# EAGLE design fan_thermo_board (EAGLE 6.4)
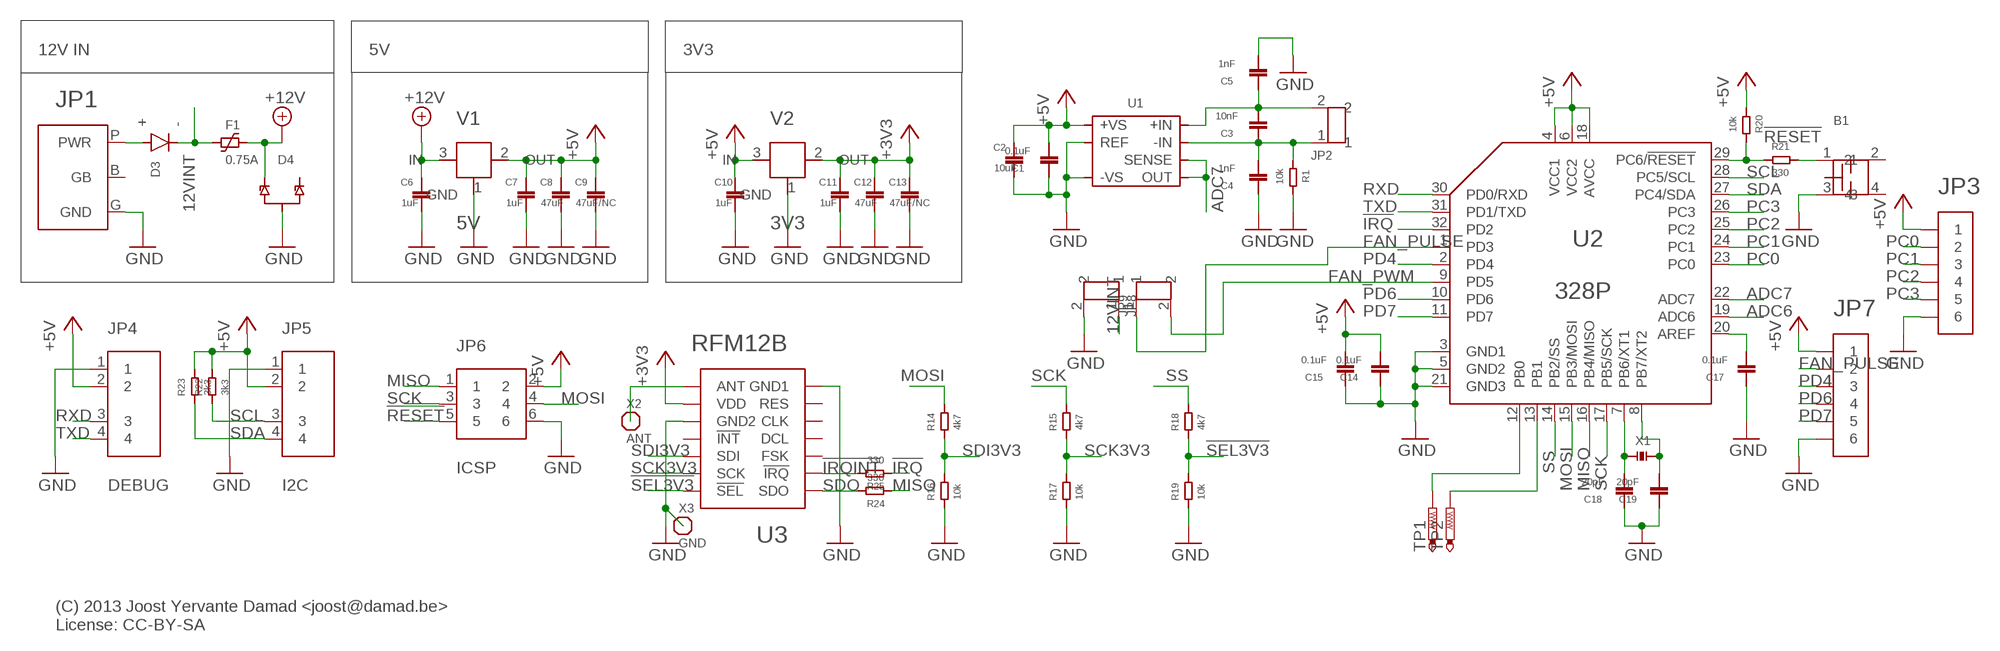
[diagram p0: schematic, sheet 1]

## Parts
B1  BUTTON_ALPS_5.2MM_SMD  [BUTTON_ALPS_SMD_5.2MM_SKQG]
C1  0.1uF  C0603  [0603@1]
C2  10uF  CAPACITOR1206  [1206]
C3  10nF  C0603  [0603@1]
C4  1nF  C0603  [0603@1]
C5  1nF  C0603  [0603@1]
C6  1uF  CAPACITOR0603  [0603]
C7  1uF  CAPACITOR0603  [0603]
C8  47uF  CAPACITOR1206  [1206]
C9  47uF/NC  CAPACITOR1206  [1206]
C10  1uF  CAPACITOR0603  [0603]
C11  1uF  CAPACITOR0603  [0603]
C12  47uF  CAPACITOR1206  [1206]
C13  47uF/NC  CAPACITOR1206  [1206]
C14  0.1uF  C0603  [0603@1]
C15  0.1uF  C0603  [0603@1]
C17  0.1uF  C0603  [0603@1]
C18  20pF  C0603  [0603@1]
C19  20pF  C0603  [0603@1]
D3  DIODE  [TAIW_SEM_DIODE]
D4  DUAL_TVSSOT-23  [SOT-23]
F1  0.75A  TE_POLYFUSE_1812  [TE_POLYFUSE_1812]
JP1  POWER_PLUG_2.1MM  [POWER_PLUG_2.1MM]
JP2  WAGO500-2PIN  [WAGO_500_SCREW_TERMINAL_2_PIN]
JP3  PIN1X6  [PIN_1X6]
JP4  DEBUG  PIN1X4PTH2.54  [PIN_1X4]
JP5  I2C  PIN1X4JSTSIDE  [JST-S-4B-XH-A]
JP6  ICSP  PIN2X32X3ALT  [PIN_2X3_ALT]
JP7  PIN1X6  [PIN_1X6]
JP8  WAGO500-2PIN  [WAGO_500_SCREW_TERMINAL_2_PIN]
JP9  WAGO500-2PIN  [WAGO_500_SCREW_TERMINAL_2_PIN]
R1  10k  RESISTOR0603  [0603]
R14  4k7  RESISTOR0603  [0603]
R15  4k7  RESISTOR0603  [0603]
R16  10k  RESISTOR0603  [0603]
R17  10k  RESISTOR0603  [0603]
R18  4k7  RESISTOR0603  [0603]
R19  10k  RESISTOR0603  [0603]
R20  10k  RESISTOR0603  [0603]
R21  330  RESISTOR0603  [0603]
R22  3k3  RESISTOR0603  [0603]
R23  3k3  RESISTOR0603  [0603]
R24  330  RESISTOR0603  [0603]
R25  330  RESISTOR0603  [0603]
TP1  PTR1B1,27  [B1,27]
TP2  PTR1B1,27  [B1,27]
U1  AD8495  [JEDEC_MO-187-AA]
U2  328P  ATMEGA328PTQFP32  [TQFP32]
U3  RFM12B  [RFM12B]
V1  5V  VREG_MCP1703  [SOT-23A]
V2  3V3  VREG_MCP1703  [SOT-23A]
X1  CRYSTAL  [CRYSTAL_2-PAD_5X3.2MM]
X2  ANT  PIN1X1  [PIN_1X1]
X3  GND  PIN1X1  [PIN_1X1]

## Nets
12VINT: D3.- F1.1 JP8.1
!IRQ: R25.1 U2.32(PD2)
!IRQINT: R25.2 U3.NIRQ(!IRQ)
!RESET: JP6.5 R20.2 R21.1 U2.29(PC6/!RESET)
!SEL3V3: R18.1 R19.2 U3.NSEL(!SEL)
+3V3: C11.2 C12.1 C13.1 U3.VDD V2.2(OUT)
+5V: C1.1 C2.1 C7.2 C8.1 C9.1 C10.2 C14.1 C15.1 JP3.1 JP4.2 JP5.2 JP6.2 JP7.1 R20.1 R22.2 R23.2 U1.7(+VS) U2.4(VCC1) U2.6(VCC2) U2.18(AVCC) V1.2(OUT) V2.3(IN)
+12V: C6.2 D4.1 F1.2 V1.3(IN)
ADC6: U2.19(ADC6)
ADC7: U1.5(SENSE) U1.6(OUT) U2.22(ADC7)
FAN_PULSE: JP7.2 JP9.1 U2.1(PD3)
FAN_PWM: JP9.2 U2.9(PD5)
GND: B1.3 C1.2 C2.2 C4.2 C5.1 C6.1 C7.1 C8.2 C9.2 C10.1 C11.1 C12.2 C13.2 C14.2 C15.2 C17.2 C18.2 C19.2 D4.3(G1) JP1.G(GND) JP3.6 JP4.1 JP5.1 JP6.6 JP7.6 JP8.2 R1.2 R16.1 R17.1 R19.1 U1.2(REF) U1.3(-VS) U2.3(GND1) U2.5(GND2) U2.21(GND3) U3.GND@1(GND1) U3.GND@2(GND2) V1.1(GND) V2.1(GND) X3.1
IN+: C3.1 C5.2 JP2.2 U1.8(+IN)
IN-: C3.2 C4.1 JP2.1 R1.1 U1.1(-IN)
MISO: JP6.1 R24.1 U2.16(PB4/MISO)
MOSI: JP6.4 R14.2 U2.15(PB3/MOSI)
N$3: TP2.TP U2.13(PB1)
N$4: TP1.TP U2.12(PB0)
N$11: D3.+ JP1.P(PWR)
N$13: U3.ANT X2.1
N$14: C17.1 U2.20(AREF)
N$16: B1.1 R21.2
N$17: C18.1 U2.7(PB6/XT1) X1.1
N$18: C19.1 U2.8(PB7/XT2) X1.2
PC0: JP3.2 U2.23(PC0)
PC1: JP3.3 U2.24(PC1)
PC2: JP3.4 U2.25(PC2)
PC3: JP3.5 U2.26(PC3)
PD4: JP7.3 U2.2(PD4)
PD6: JP7.4 U2.10(PD6)
PD7: JP7.5 U2.11(PD7)
RXD: JP4.3 U2.30(PD0/RXD)
SCK: JP6.3 R15.2 U2.17(PB5/SCK)
SCK3V3: R15.1 R17.2 U3.SCK
SCL: JP5.3 R22.1 U2.28(PC5/SCL)
SDA: JP5.4 R23.1 U2.27(PC4/SDA)
SDI3V3: R14.1 R16.2 U3.SDI
SDO: R24.2 U3.SDO
SS: R18.2 U2.14(PB2/SS)
TXD: JP4.4 U2.31(PD1/TXD)
Unconnected: B1.2 B1.4 D4.2 JP1.B(GB) U3.CLK U3.DCL U3.FSK U3.NINT(!INT) U3.RES

## Notes on the sheet
- 12V IN | 5V | 3V3
- (C) 2013 Joost Yervante Damad <joost@damad.be>
  License: CC-BY-SA

## Library data of the parts
B1 = 01jyd:BUTTON_ALPS_5.2MM_SMD
C1 C3-C5 C14 C15 C17-C19 = 01jyd:C0603
C2 C6-C13 = 01jyd:CAPACITOR
D3 = 01jyd:DIODE
D4 = 01jyd:DUAL_TVS
F1 = 01jyd:TE_POLYFUSE_1812
JP1 = 01jyd:POWER_PLUG_2.1MM
JP2 JP8 JP9 = 01jyd:WAGO500-2PIN
JP3 JP7 = 01jyd:PIN1X6
JP4 JP5 = 01jyd:PIN1X4
JP6 = 01jyd:PIN2X3
R1 R14-R25 = 01jyd:RESISTOR
TP1 TP2 = testpad:PTR1: TEST PIN
U1 = 01jyd:AD8495
U2 = 01jyd:ATMEGA328P
U3 = 01jyd:RFM12B
V1 V2 = 01jyd:VREG_MCP1703
X1 = 01jyd:CRYSTAL
X2 X3 = 01jyd:PIN1X1

## Net classes
1 high power: width 1 mm

## Board
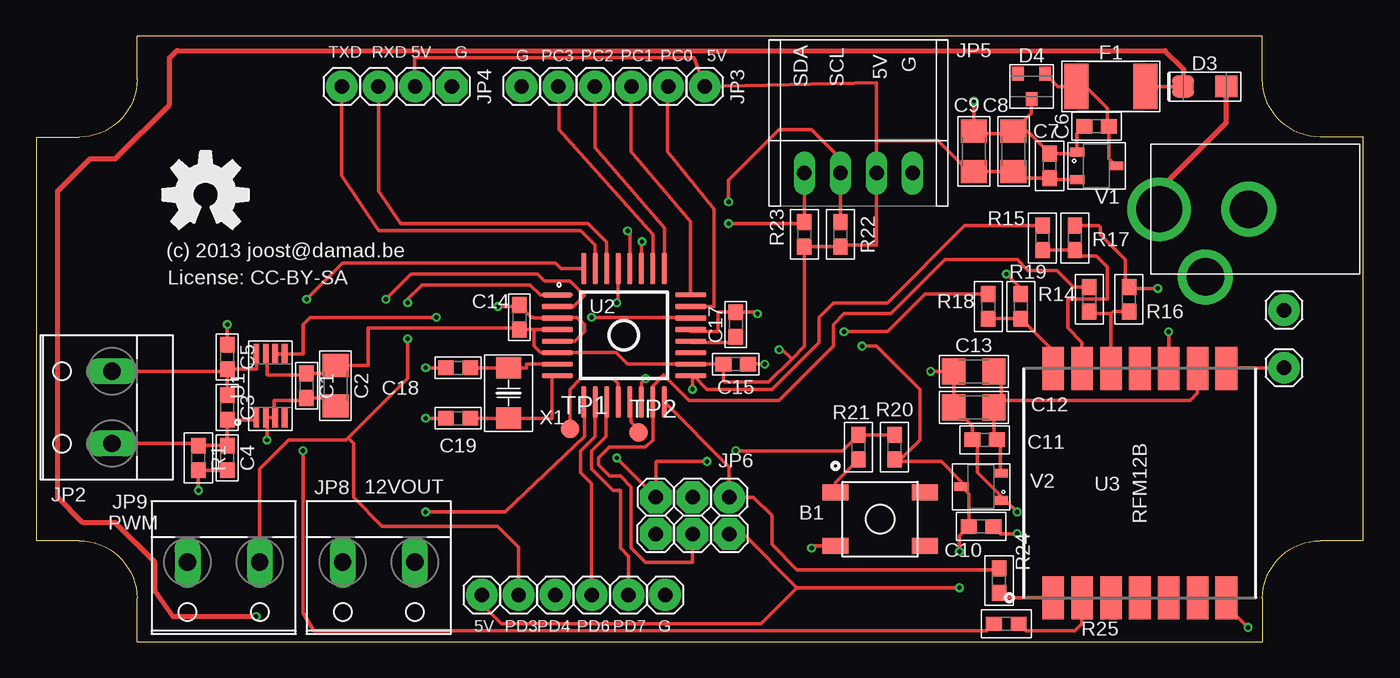
[diagram p1: board, top side]
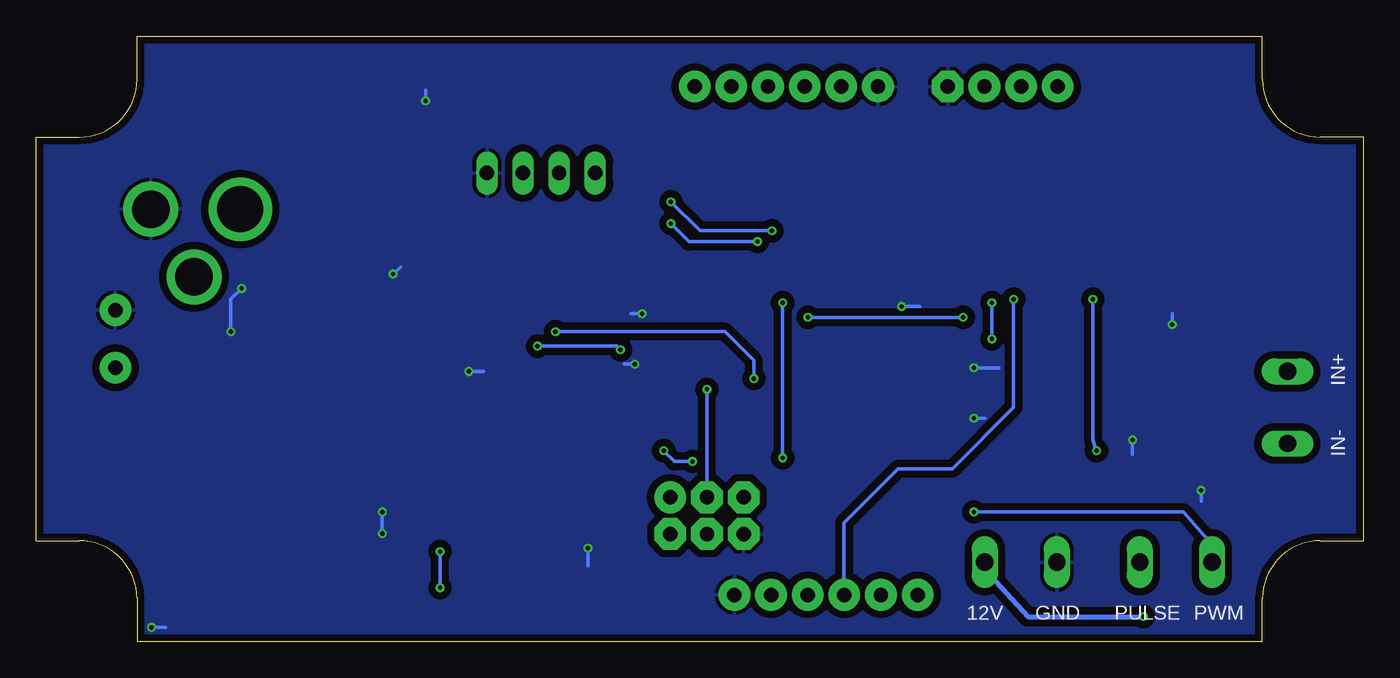
[diagram p2: board, bottom side, seen from below]

Size 92 x 42 mm. Coordinates in mm from the lower left corner, seen from the top.
Outline: 7,0 85,0 85,3 arc-90 89,7 92,7 92,35 89,35 arc-90 85,39 85,42 7,42 7,39 arc-90 3,35 0,35 0,7 3,7 arc-90 7,3 7,0
Copper layers (1*2*15*16): Top 0.035mm / dielectric 0.2mm / Route2 0.0175mm / dielectric 1.1mm / Route15 0.0175mm / dielectric 0.2mm / Bottom 0.035mm
Design rules "SeeedStudio_DRU_no_angle_20130527": minimum track width 6mil, minimum drill 12mil, track to track 6mil, track to pad 6mil, pad to pad 6mil, via to via 6mil, smd to smd 0mil, copper to edge 10mil, drill to drill 10mil, minimum pad ring 6mil, minimum via ring 6mil, stop-mask expansion 2mil, vias tented up to drill 25mil, thermal gap 10mil

### Footprints (pad centres in the part's own frame; a part is rotated, then mirrored left to right if it is on the bottom)
BUTTON_ALPS_SMD_5.2MM_SKQG = smd 1.8 x 1.1: 1 -3.1,1.85; 2 3.1,1.85; 3 -3.1,-1.85; 4 3.1,-1.85
0603@1 = smd 1.1 x 1: 1 -0.85,0; 2 0.85,0
1206 = smd 1.6 x 1.8: 1 -1.4,0; 2 1.4,0
0603 = smd 1.1 x 1: 1 -0.85,0; 2 0.85,0
TAIW_SEM_DIODE = smd 1.5 x 1.5: + 1.5,0; - -1.5,0
SOT-23 = smd 0.802 x 0.972: 1 -0.95,-0.885; 2 0.95,-0.885; 3 0,0.885
TE_POLYFUSE_1812 = smd 1.68 x 3.15: 1 -2.39,0; 2 2.39,0
POWER_PLUG_2.1MM = drill 2.6 pad 3.8: B 3.45,4.7; G 0.45,0 | drill 3.2 pad 4.4: P 6.65,0
WAGO_500_SCREW_TERMINAL_2_PIN = drill 1.2 long: 1 -2.5,-1.27; 2 2.5,-1.27
PIN_1X6 = drill 1 pad 2.2: 1 0,6.35; 2 0,3.81; 3 0,1.27; 4 0,-1.27; 5 0,-3.81; 6 0,-6.35
PIN_1X4 = drill 1 pad 2.2 octagon: 1 0,3.81 | drill 1 pad 2.2: 2 0,1.27; 3 0,-1.27; 4 0,-3.81
JST-S-4B-XH-A = drill 1 long: 1 3.75,0; 2 1.25,0; 3 -1.25,0; 4 -3.75,0
PIN_2X3_ALT = drill 1 pad 2.2: 1 -1.27,2.54 | drill 1 pad 2.2 octagon: 2 1.27,2.54; 3 -1.27,0; 4 1.27,0; 5 -1.27,-2.54; 6 1.27,-2.54
B1,27 = smd 1.27 x 1.27: TP 0,0
JEDEC_MO-187-AA = smd 1.4 x 0.4: 1 -2.2,0.975; 2 -2.2,0.325; 3 -2.2,-0.325; 4 -2.2,-0.975; 5 2.2,-0.975; 6 2.2,-0.325; 7 2.2,0.325; 8 2.2,0.975
TQFP32 = smd 2.17 x 0.36: 1 -4.625,2.8; 2 -4.625,2; 3 -4.625,1.2; 4 -4.625,0.4; 5 -4.625,-0.4; 6 -4.625,-1.2; 7 -4.625,-2; 8 -4.625,-2.8; 17 4.625,-2.8; 18 4.625,-2; 19 4.625,-1.2; 20 4.625,-0.4; 21 4.625,0.4; 22 4.625,1.2; 23 4.625,2; 24 4.625,2.8 | smd 0.36 x 2.17: 9 -2.8,-4.625; 10 -2,-4.625; 11 -1.2,-4.625; 12 -0.4,-4.625; 13 0.4,-4.625; 14 1.2,-4.625; 15 2,-4.625; 16 2.8,-4.625; 25 2.8,4.625; 26 2,4.625; 27 1.2,4.625; 28 0.4,4.625; 29 -0.4,4.625; 30 -1.2,4.625; 31 -2,4.625; 32 -2.8,4.625
RFM12B = smd 3 x 1.5: ANT 7.95,-6; CLK -7.95,-2; DCL -7.95,0; FSK -7.95,2; GND@1 -7.95,-6; GND@2 7.95,-2; NINT 7.95,0; NIRQ -7.95,4; NSEL 7.95,6; RES -7.95,-4; SCK 7.95,4; SDI 7.95,2; SDO -7.95,6; VDD 7.95,-4
SOT-23A = smd 0.6 x 1: 1 -0.95,-1.35; 2 0.95,-1.35; 3 0,1.35
CRYSTAL_2-PAD_5X3.2MM = smd 1.5 x 1.7: 1 -1.75,0; 2 1.75,0
PIN_1X1 = drill 1 pad 2.2: 1 0,0

### Placement (x,y rotation side)
B1  58.5,8.5 0 top
C1  18.75,17.75 270 top
C2  20.75,17.75 270 top
C3  13.25,16.25 270 top
C4  13.25,12.75 270 top
C5  13.25,19.75 270 top
C6  73.5,35.75 0 top
C7  70.25,33 270 top
C8  67.75,34 90 top
C9  65,34 90 top
C10  65.5,8 180 top
C11  65.75,14 0 top
C12  65,16.25 180 top
C13  65,18.75 180 top
C14  33.5,22.5 90 top
C15  48.5,19.25 0 top
C17  48.5,22 90 top
C18  29.25,19 180 top
C19  29.25,15.5 180 top
D3  81,38.5 0 top
D4  69,38.5 180 top
F1  74.5,38.5 180 top
JP1  84.5,30 180 top
JP2  4,16.25 90 top
JP3  40,38.5 270 top
JP4  25,38.5 270 top
JP5  57,32.5 0 top
JP6  45.5,8.75 270 top
JP7  37.25,3.25 90 top
JP8  23.75,4.25 180 top
JP9  13,4.25 180 top
R1  11.25,12.75 270 top
R14  73,23.75 90 top
R15  69.75,28 90 top
R16  75.75,23.75 270 top
R17  72,28 270 top
R18  66,23.25 90 top
R19  68.25,23.25 270 top
R20  59.5,13.5 90 top
R21  57,13.5 270 top
R22  55.75,28.25 270 top
R23  53.25,28.25 270 top
R24  66.75,4.25 270 top
R25  67.25,1.25 0 top
TP1  37,14.75 0 top
TP2  41.75,14.5 0 top
U1  16.25,17.75 90 top
U2  40.75,21.25 0 top
U3  76.5,11 90 top
V1  73.5,33 270 top
V2  65.5,10.75 90 top
X1  32.75,17.25 270 top
X2  86.5,19 0 top
X3  86.5,23 0 top

### Tracks (layer width: path | path; a pad name or v marks a point on that pad's centre or on a via)
12VINT  (via drill 0.3 pad 0.3)
  Top 0.25: D3.- F1.1
  Top 0.35: v15.25,1.75 9.5,1.75 8.25,3.5 8.25,5.5 5.5,8.25 3.25,8.25 1.5,10 1.5,31.25 3.75,33.5 5.5,33.5 9.25,37.25 9.25,40.5 9.75,41 78.25,41 79.5,39.75 D3.-
  Bottom 0.35: JP8.1 26.25,5 23.25,1.75 v15.25,1.75
!IRQ  (via drill 0.3 pad 0.3)
  Top 0.25: U2.32 36.38,25.88 36,26.25 21.25,26.25 v18.75,23.75 | v18.5,13.25 18.5,2 19.25,0.75 65.9,0.75 R25.1
  Bottom 0.25: v18.75,23.75 18.75,14 v18.5,13.25
!IRQINT
  Top 0.25: U3.NIRQ 72.5,1.25 72,0.75 68.6,0.75 R25.2
!RESET  (via drill 0.3 pad 0.3)
  Top 0.25: R20.2 R21.1 55.9,13.25 v48.5,13.25 | U2.29 40.35,23.6 v40.25,23.5 | v40.25,12.75 40.25,12.73 JP6.5 42.96,12.46 43,12.5 v46.5,12.5
  Bottom 0.25: v40.25,23.5 v40.25,12.75 | v46.5,12.5 47.75,12.5 v48.5,13.25
!SEL3V3
  Top 0.25: U3.NSEL 70.5,20.15 R19.2 R18.1
+3V3
  Top 0.25: U3.VDD 80.5,17.25 80,16.75 66.9,16.75 | 66.9,16.75 C12.1 66.4,14.2 C11.2 66.85,13.75 V2.2 | 66.9,16.75 66.9,18.25 C13.1
+5V  (via drill 0.3 pad 0.3)
  Top 0.25: U1.7 16,19.95 16,18.5 18.75,18.5 C1.1 20.75,18.6 C2.1 23,19.15 23,21.75 33.5,21.75 C14.1 34.5,21.65 | U2.4 34.5,21.65 | 58.25,34.75 JP5.2 58.25,27.5 55.75,27.5 R22.2 R23.2 53.25,20.5 52.38,19.62 | 58.25,34.75 58.25,38.75 46.1,38.5 JP3.1 45.6,40.5 26.25,40.5 26.25,38.5 JP4.2 | V1.2 70.35,32.05 C7.2 68.2,32.15 C8.1 C9.1 64.65,32.6 62.5,34.75 58.25,34.75 | 52.38,19.62 50.75,18 47.75,18 47.65,18.1 C15.1 U2.18 41,19.25 40.2,20.05 U2.6 34.95,20.05 34.5,20.5 34.5,21.65 | JP6.2 49.02,7.48 52.75,3.75 | 52.75,3.75 v64,3.75 | v64,6.25 64,7.35 C10.2 64.65,10.25 V2.3 64.15,11.1 62.75,12.5 59.65,12.5 R20.1 59.9,12.65 61.25,14 61.25,17.5 58.25,20.5 v57.25,20.5 | v51.5,20.25 51.75,20.25 52.38,19.62 | JP7.1 30.9,2.6 32.25,1.25 50.25,1.25 52.75,3.75
  Bottom 0.25: v64,3.75 v64,6.25 | v57.25,20.5 51.75,20.5 v51.5,20.25
+12V
  Top 0.25: D4.1 70.83,38.5 F1.2 72.75,38.5 74.25,37 74.25,35.85 C6.2 74.35,33.5 V1.3
ADC7  (via drill 0.3 pad 0.3)
  Top 0.25: U1.6 U1.5 18.5,19.95 18.5,22 19,22.5 v27.75,22.5 | v38.5,22.5 45.33,22.5 U2.22
  Bottom 0.25: v27.75,22.5 v38.5,22.5
FAN_PULSE  (via drill 0.3 pad 0.3)
  Top 0.25: 25.73,20.98 v25.75,21 25.75,18.25 21.62,14.12 | v25.75,23.5 25.75,23.75 26.75,24.75 34.25,24.75 34.95,24.05 U2.1 | JP9.1 15.5,12 17.5,14 21.5,14 21.62,14.12 | 21.62,14.12 22,13.75 22,10 24,8 32,8 33.44,6.56 JP7.2
  Bottom 0.25: v25.75,21 v25.75,23.5
FAN_PWM  (via drill 0.3 pad 0.3)
  Top 0.25: v27,9 32.5,9 38,14.25 38,16.57 U2.9
  Bottom 0.25: v27,9 12.5,9 10.5,6.75 JP9.2
GND  (via drill 0.3 pad 0.3)
  Top 0.25: v11.25,10.5 R1.2 C4.2 | v16,14 16,15.55 U1.2 U1.3 16.5,15.55 16.5,16.75 18.75,16.75 C1.2 20.75,16.9 C2.2 | C5.1 v13.25,22 | C19.2 v27,15.5 | C18.2 v27,19 | v32,23.25 33.5,23.25 C14.2 34.35,22.5 34.5,22.5 34.55,22.45 U2.3 36.17,22.5 37.5,22.5 38,22 38,21.5 37.35,20.85 U2.5 | U2.21 45.38,21.5 47.25,21.5 47.25,22.85 C17.2 50,22.85 v50,22.75 | C15.2 v50.5,19.25 | D4.3 69,36.65 C8.2 | C8.2 67.6,35.25 65.25,35.25 65.1,35.4 C9.2 v65,37.5 | C8.2 68.7,35.4 C7.1 72.05,33.85 V1.1 72.15,35.25 C6.1 | U3.GND@1 82.5,2.5 v84,1 | U3.GND@2 v78.5,21.5 | v77.75,24.5 75.85,24.5 R16.1 75.5,24.85 75.5,26.5 73.75,28.25 73.75,28.75 73.65,28.85 R17.1 | v62,18.75 C13.2 C12.2 64.9,14.95 C11.1 65.25,13.65 65.25,11.75 66.85,10.15 V2.1 67.2,9.8 v68,9 | v68,7.5 66.85,7.5 C10.1 | B1.3 53.9,6.65 v53.75,6.5 | R19.1 68.25,24.5 v67.25,25.5
  Bottom 0.25: v11.25,10.5 11.25,9.75 | v16,14 16,13 | v13.25,22 13.25,22.75 | v27,15.5 26.25,15.5 | v27,19 25.25,19 | v32,23.25 30.75,23.25 | v50,22.75 50.75,22.75 | v50.5,19.25 51.25,19.25 | v65,37.5 65,38.25 | v84,1 83,1 | v78.5,21.5 78.5,23.75 v77.75,24.5 | v62,18.75 61,18.75 | v68,9 v68,7.5 | v53.75,6.5 53.75,5.25 | v67.25,25.5 66.75,26
  pour Bottom (isolate 0.5): 0,42 0,0 92,0 92,42
IN+
  Top 0.25: JP2.2 13.25,18.75 C5.2 | C5.2 C3.1 | C5.2 15.28,18.9 U1.8
IN-
  Top 0.25: JP2.1 11.25,13.75 R1.1 C4.1 C3.2 15.28,15.4 U1.1
MISO
  Top 0.25: U2.16 48.04,12.13 JP6.1 49.73,10.02 51,8.75 51,6.75 52.75,5 66.65,5 R24.1
MOSI
  Top 0.25: R14.2 71.9,24.6 70.75,25.75 68.75,25.75 68,26.5 63,26.5 59.25,22.75 56,22.75 55.25,22 55.25,20.5 51.5,16.75 45.25,16.75 43.5,18.5 42.75,17.75 U2.15 42.75,14 42.25,13.5 39.75,13.5 39,12.75 39,12.25 39.75,11.5 40.5,11.5 41.25,10.75 41.25,6.5 42.25,5.5 45.5,5.5 JP6.4
N$3
  Top 0.25: TP2.TP 41.75,14.75 41.25,15.25 41.25,16.52 U2.13
N$4
  Top 0.25: U2.12 40.35,17.9 40,18.25 37.75,18.25 37,17.5 TP1.TP
N$11
  Top 0.35: JP1.P 77.85,31.35 82.5,36 D3.+
N$13
  Top 0.25: X2.1 82.5,19 U3.ANT
N$14
  Top 0.25: C17.1 48.5,20.75 45.38,20.75 U2.20
N$15
  Top 0.2: 12.54,29.09 arc9 12.84,29.25 13.6,28.64 14.11,29.15 13.5,29.91 arc19 13.76,30.54 14.73,30.63 14.73,31.37 13.76,31.46 arc19 13.5,32.09 14.11,32.85 13.6,33.36 12.84,32.75 arc19 12.21,33.01 12.12,33.98 11.38,33.98 11.29,33.01 arc19 10.66,32.75 9.9,33.36 9.39,32.85 10,32.09 arc19 9.74,31.46 8.77,31.37 8.77,30.63 9.74,30.54 arc19 10,29.91 9.39,29.15 9.9,28.64 10.66,29.25 arc9 10.96,29.09 11.39,30.13 arc-68 10.81,31 arc-248 12.11,30.13 12.54,29.09
N$16
  Top 0.25: B1.1 55.4,11.05 R21.2
N$17
  Top 0.25: C18.1 X1.1 34,19 34,19.25 U2.7
N$18
  Top 0.25: C19.1 X1.2 35.75,15.5 35.75,18.45 U2.8
PC0
  Top 0.25: U2.23 47,23.25 47,30 43.75,34 43.75,38.44 JP3.2
PC1
  Top 0.25: U2.24 45.38,29.12 41.25,34 41.25,38.48 JP3.3
PC2
  Top 0.25: U2.25 43.55,28.7 38.75,34.25 38.75,38.48 JP3.4
PC3
  Top 0.25: U2.26 42.75,28.25 36.25,35.5 36.25,38.44 JP3.5
PD4  (via drill 0.3 pad 0.3)
  Top 0.25: U2.2 37.25,23.25 38,24 37,25 35.25,25 34.75,25.5 26,25.5 v24.25,23.75
  Bottom 0.25: v24.25,23.75 24.25,16.25 28.5,12 32.25,12 36,8.25 36,3.27 JP7.3
PD6
  Top 0.25: U2.10 38.75,14.23 38.73,14.23 37.75,13.25 37.75,11.75 38.5,11 38.5,3.27 JP7.4
PD7
  Top 0.25: U2.11 39.5,16.57 39.5,14.25 38.5,13.25 38.5,12 40,10.5 40.5,10.5 40.5,6.5 41.06,5.94 JP7.5
RXD
  Top 0.25: U2.30 39.55,27.7 38.25,29 25.25,29 23.75,31.25 23.75,38.48 JP4.3
SCK  (via drill 0.3 pad 0.3)
  Top 0.25: R15.2 64.35,28.85 59,23.5 55.25,23.5 54.25,22.5 54.25,20.75 51,17.5 46.5,17.5 45.55,18.45 U2.17 45.5,18.32 v45.5,17.5
  Bottom 0.25: JP6.3 v45.5,17.5
SCK3V3
  Top 0.25: R15.1 R17.2 72.4,26.75 73.5,26.75 74.25,26 74.25,23.75 71.5,23.75 71.5,21.75 72.5,20.75 U3.SCK
SCL  (via drill 0.3 pad 0.3)
  Top 0.25: R22.1 JP5.3 55.75,33.5 53.75,35.5 51.5,35.5 48,32 v48,30.5 | U2.28 41.15,28.35 v41,28.5
  Bottom 0.25: v41,28.5 46,28.5 v48,30.5
SDA  (via drill 0.3 pad 0.3)
  Top 0.25: JP5.4 R23.1 53.15,29 v48,29 | U2.27 41.95,27.7 v42,27.75
  Bottom 0.25: v42,27.75 46.75,27.75 v48,29
SDI3V3
  Top 0.25: U3.SDI 74.5,22.75 | 74.5,22.75 73.65,22.75 R14.1 | R16.2 74.65,22.9 74.5,22.75
SDO
  Top 0.25: U3.SDO 67.1,3.05 R24.2
SS  (via drill 0.3 pad 0.3)
  Top 0.25: R18.2 61.6,24.1 59,21.5 v56,21.5 | U2.14 41.95,17.95 v42.25,18.25
  Bottom 0.25: v42.25,18.25 42.25,19.5 44.25,21.5 v56,21.5
TXD
  Top 0.25: JP4.4 21.19,32.31 23.75,28.5 37.75,28.5 38.75,27.5 U2.31

### Text on the board
tPlace: TXD | RXD | 5V | G | G | PC3 | PC2 | PC1 | PC0 | 5V | G | 5V | SDA | SCL | (c) 2013 joost@damad.be | License: CC-BY-SA | 12VOUT | PWM | 5V | PD3 | PD4 | PD6 | PD7 | G
bPlace: IN+ | IN- | PWM | PULSE | GND | 12V